# EAGLE design VL53L1X-TOF-Sensor (EAGLE 9.6.2)
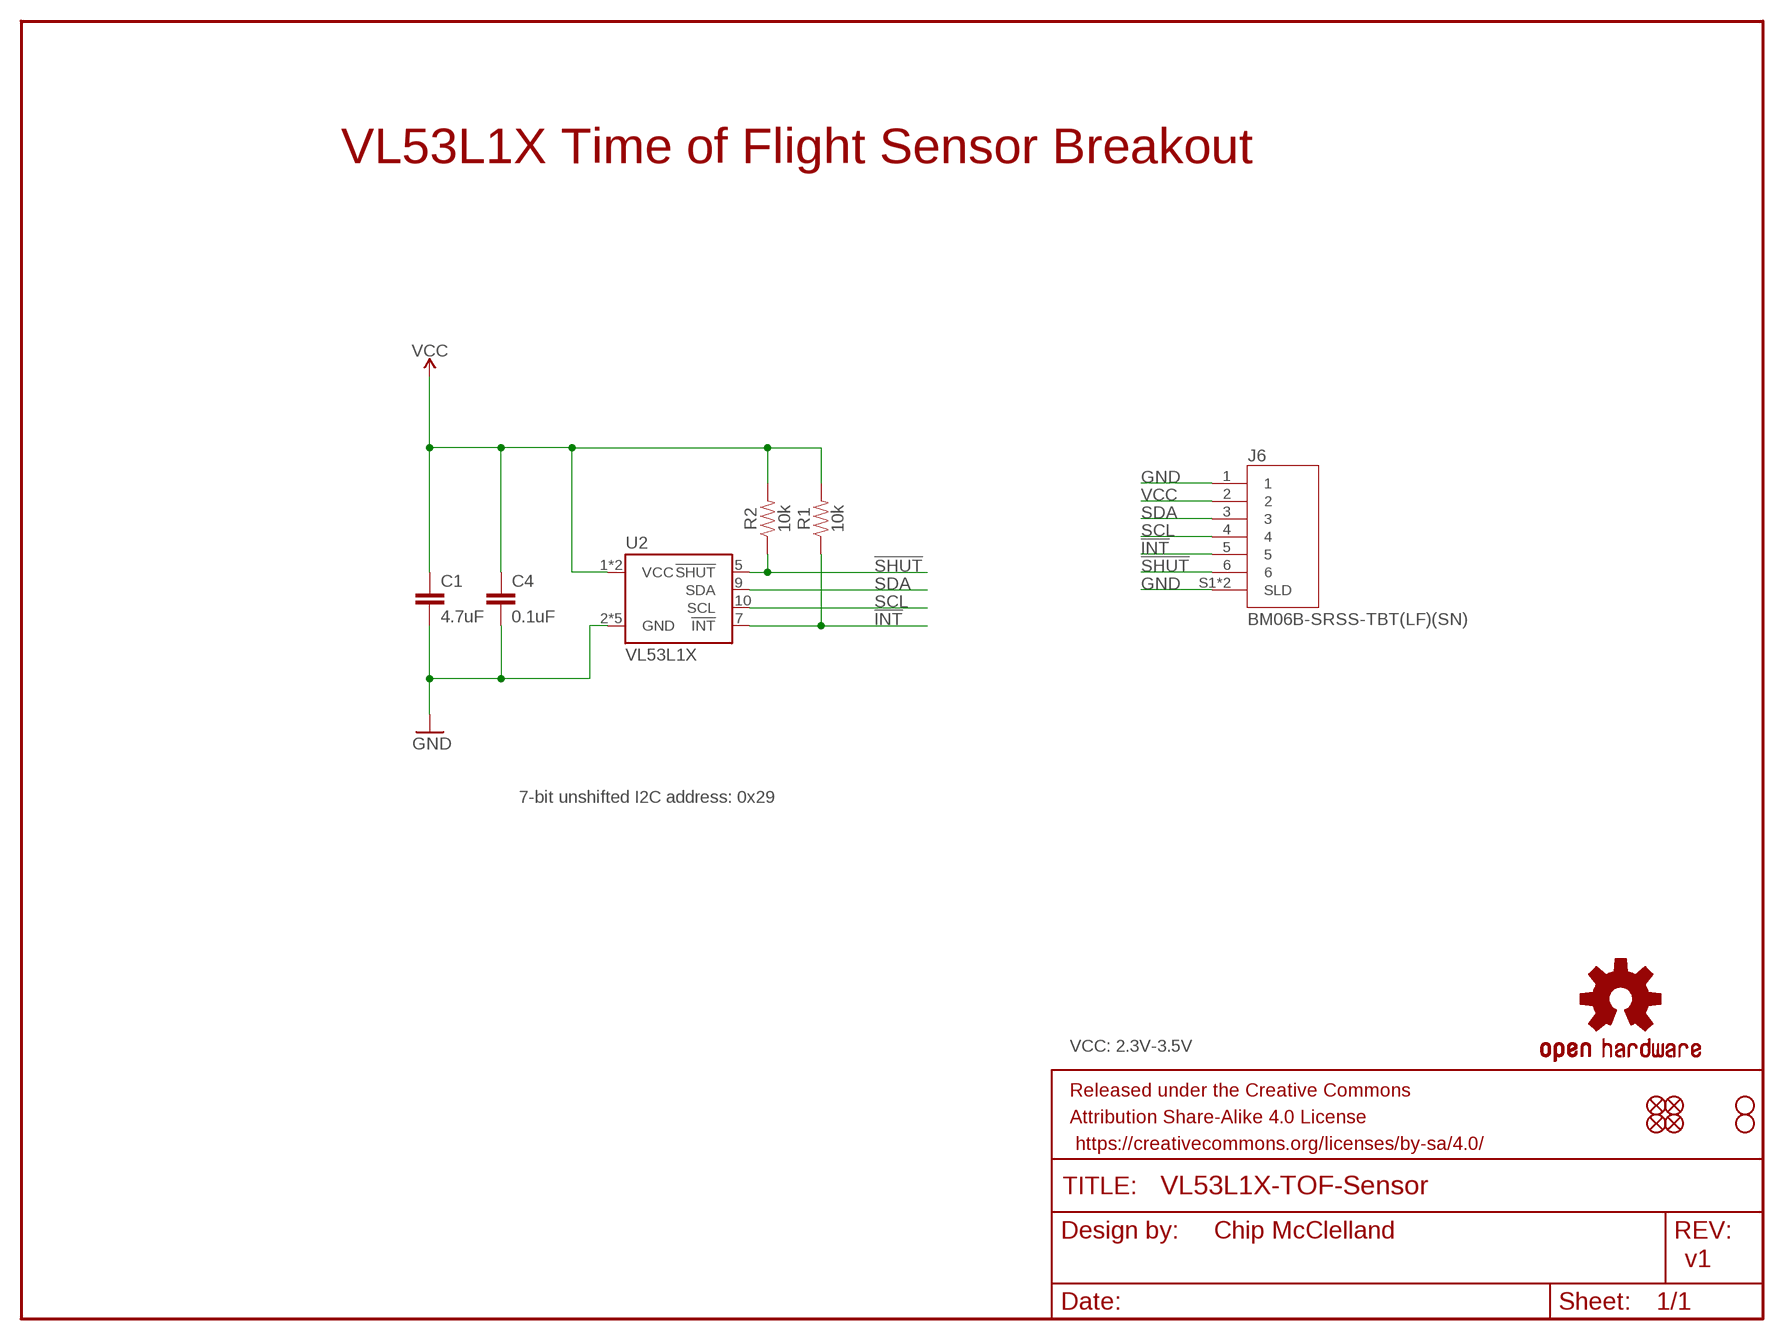
[diagram p0: schematic, sheet 1]

## Parts
C1  4.7uF  4.7UF0603  [0603]
C4  0.1uF  0.1UF-0603-25V-(+80/-20%)  [0603]
FRAME1  FRAME-LETTER  [CREATIVE_COMMONS]
J6  BM06B-SRSS-TBT(LF)(SN)  [JST_BM06B-SRSS-TB(LF)(SN)]
JP1  FIDUCIALUFIDUCIAL  [MICRO-FIDUCIAL]
JP2  FIDUCIALUFIDUCIAL  [MICRO-FIDUCIAL]
JP3  STAND-OFF  [STAND-OFF]
JP4  STAND-OFF  [STAND-OFF]
JP5  FIDUCIALUFIDUCIAL  [MICRO-FIDUCIAL]
JP6  FIDUCIALUFIDUCIAL  [MICRO-FIDUCIAL]
LOGO1  OSHW-LOGOMINI  [OSHW-LOGO-MINI]
R1  10k  10KOHM-0603-1/10W-1%  [0603]
R2  10k  10KOHM-0603-1/10W-1%  [0603]
U2  VL53L1X  VL53L1XSMD  [VL53L1X]

## Nets
!INT: J6.5 R1.1 U2.7(!INT)
!SHUT: J6.6 R2.1 U2.5(!SHUT)
GND: C1.2 C4.2 J6.1 J6.S1(SLD) J6.S2(SLD) U2.2(GND) U2.3(GND) U2.4(GND) U2.6(GND) U2.12(GND)
SCL: J6.4 U2.10(SCL)
SDA: J6.3 U2.9(SDA)
VCC: C1.1 C4.1 J6.2 R1.2 R2.2 U2.1(VCC) U2.11(VCC)

## Notes on the sheet
- VL53L1X Time of Flight Sensor Breakout
- 7-bit unshifted I2C address: 0x29
- VCC: 2.3V-3.5V
- Chip McClelland
- v1

## Library data of the parts
C1 = SparkFun-Capacitors:4.7UF: 4.7µF ceramic capacitors A capacitor is a passive two-terminal electrical component used to store electrical energy temporarily in an electric field.; PROD_ID: CAP-08280
C4 = SparkFun-Capacitors:0.1UF: 0.1µF ceramic capacitors A capacitor is a passive two-terminal electrical component used to store electrical energy temporarily in an electric field.; PROD_ID: CAP-00810
FRAME1 = SparkFun-Aesthetics:FRAME-LETTER: Schematic Frame - Letter Standard 8.5x11 US Letter frame
J6 = Custom Components:BM06B-SRSS-TBT(LF)(SN): 6 Position 1.0mm Top-Entry Surface Mount Shrouded Header; MPN: BM06B-SRSS-TBT(LF)(SN); POPULATE: 1
JP1 JP2 JP5 JP6 = SparkFun:FIDUCIAL: Fiducial Alignment Points Various fiducial points for machine vision alignment.
JP3 JP4 = SparkFun:STAND-OFF: Stand Off This is the mechanical footprint for a #4 phillips button head screw. Use the keepout ring to avoid running the screw head into surrounding components. SKU : PRT-00447
LOGO1 = SparkFun-Aesthetics:OSHW-LOGO: Open-Source Hardware (OSHW) Logo This logo indicates the piece of hardware it is found on incorporates a OSHW license and/or adheres to the definition of open source hardware found here: http://freedomdefined.org/OSHW
R1 R2 = SparkFun-Resistors:10KOHM: 10kΩ resistor A resistor is a passive two-terminal electrical component that implements electrical resistance as a circuit element. Resistors act to reduce current flow, and, at the same time, act to lower voltage levels within circuits. - Wikipedia; PROD_ID: RES-00824
U2 = SparkFun-Sensors:VL53L1X: STMicroelectronics VL53L1X - 400 cm IR Laser ToF Sensor VL53L1X is a state-of-the-art ToF laser-ranging sensor, enhancing the ST FlightSense product family. It is the fastest miniature ToF sensor currently on the market with accurate ranging up to 4 m and fast ranging frequency (up to 50 Hz). Housed in a miniature and reflowable package, it integrates a single photon avalanche diode (SPAD) receiving array, a 940 nm invisible laser Class 1 emitter, physical infrared filters, and optics to achieve the best ranging performance in various ambient lighting conditions with a range of cover window options.; PROD_ID: IC-13960

## Net classes
1 power: width 0.203 mm

## Board
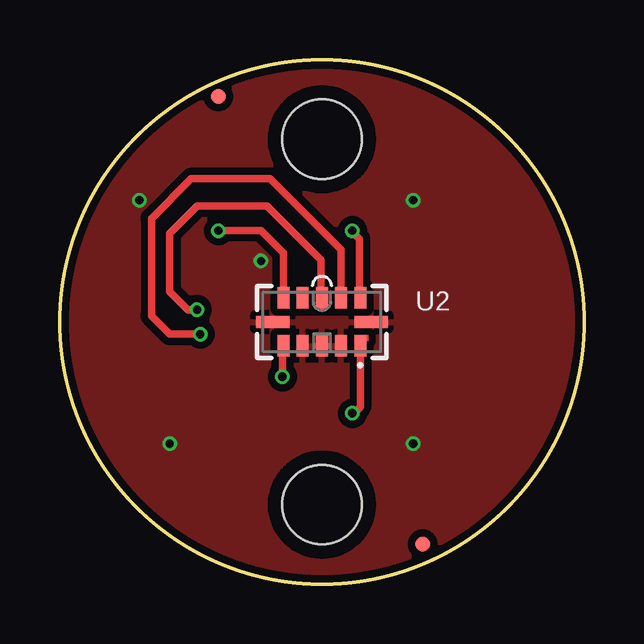
[diagram p1: board, top side]
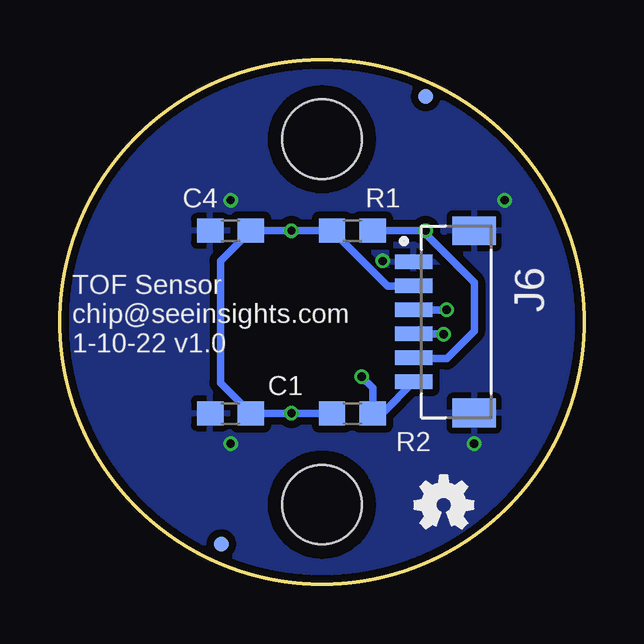
[diagram p2: board, bottom side, seen from below]

Size 21.85 x 21.85 mm. Coordinates in mm from the lower left corner, seen from the top.
Outline: circle at 10.92,10.92 radius 10.92
Copper layers (1*16): Top 0.035mm / dielectric 1.5mm / Bottom 0.035mm
Design rules "SparkFun-2-layer-FAB-LIMIT": minimum track width 4mil, minimum drill 6mil, track to track 4mil, track to pad 4mil, pad to pad 4mil, via to via 4mil, smd to smd 4mil, copper to edge 4mil, drill to drill 4mil, minimum pad ring 5mil, minimum via ring 5mil, stop-mask expansion 4mil, vias tented up to drill 25mil, thermal gap 10mil

### Footprints (pad centres in the part's own frame; a part is rotated, then mirrored left to right if it is on the bottom)
0603 = smd 1.1 x 1: 1 -0.85,0; 2 0.85,0
JST_BM06B-SRSS-TB(LF)(SN) = smd 0.6 x 1.55: 1 -2.5,-2.525; 2 -1.5,-2.525; 3 -0.5,-2.525; 4 0.5,-2.525; 5 1.5,-2.525; 6 2.5,-2.525 | smd 1.2 x 1.8: S1 -3.8,0; S2 3.8,0
MICRO-FIDUCIAL = smd 0.635 x 0.635: 1 0,0
STAND-OFF = hole 3.302: 0,0
VL53L1X = smd 0.5 x 0.9: 1 1.6,-1; 2 0.8,-1; 3 0,-1; 4 -0.8,-1; 5 -1.6,-1; 7 -1.6,1; 8 -0.8,1; 9 0,1; 10 0.8,1; 11 1.6,1 | smd 1.4 x 0.5: 6 -2.05,0; 12 2.05,0

### Placement (x,y rotation side)
C1  14.73,7.11 180 bottom
C4  14.73,14.73 180 bottom
FRAME1  -15.75,-9.4 0 top  (outside the outline)
J6  4.57,10.92 270 bottom
JP1  6.61,20.32 0 bottom
JP2  15.12,1.65 0 top
JP3  10.92,18.54 0 top
JP4  10.92,3.3 0 top
JP5  15.12,1.65 0 bottom
JP6  6.61,20.32 0 top
LOGO1  5.84,3.3 0 bottom
R1  9.65,14.73 180 bottom
R2  9.65,7.11 180 bottom
U2  10.92,10.92 0 top

### Tracks (layer width: path | path; a pad name or v marks a point on that pad's centre or on a via)
!INT  (via drill 0.35)
  Top 0.305: U2.7 9.32,13.79 8.38,14.73 v6.61,14.73
  Bottom 0.305: R1.1 v6.61,14.73 6.61,14.61 4.57,12.58 4.57,10.54 5.72,9.4 7.08,9.4 J6.5
!SHUT  (via drill 0.35)
  Top 0.305: v9.27,8.64 9.27,9.87 U2.5
  Bottom 0.305: J6.6 8.41,7.11 R2.1 8.8,8.17 v9.27,8.64
GND  (via drill 0.35)
  other vias: 14.73,5.84 14.73,16 3.3,16 4.57,5.84 8.38,13.46
  pour Bottom (isolate 0.305): -4.32,-1.78 -4.32,23.62 26.16,23.62 26.16,-1.78
  pour Top (isolate 0.305): -4.32,-1.78 -4.32,23.62 26.16,23.62 26.16,-1.78
SCL  (via drill 0.35)
  Top 0.305: U2.10 11.72,13.93 8.77,16.89 5.46,16.89 3.81,15.24 3.81,11.18 4.57,10.42 v5.84,10.42
  Bottom 0.305: v5.84,10.42 v5.85,10.42 J6.4
SDA  (via drill 0.35)
  Top 0.305: U2.9 10.88,11.97 10.88,13.51 8.64,15.75 5.72,15.75 4.57,14.61 4.57,12.19 5.34,11.43 v5.72,11.43
  Bottom 0.305: v5.72,11.43 7.09,11.43 J6.3
VCC  (via drill 0.35)
  Top 0.305: U2.11 12.48,11.97 12.48,14.38 12.19,14.67 v12.19,14.73 | U2.1 12.52,7.38 12.25,7.11 v12.19,7.11
  Bottom 0.305: R2.2 v12.19,7.11 C1.1 15.15,8.38 15.15,13.46 C4.1 v12.19,14.73 R1.2 8.19,12.42 J6.2

### Text on the board
bPlace: TOF Sensor / chip@seeinsights.com / 1-10-22 v1.0
tDocu: Chip McClelland